# EasyEDA schematic SCH_ESP32-Head-Module_2024-04-16.json
TITLE: Sheet_1; REV: 1.0; Date: 2024-04-16; Sheet: 1/1; Drawn By: fcbayernmunchenerlan999; Company: Your Company
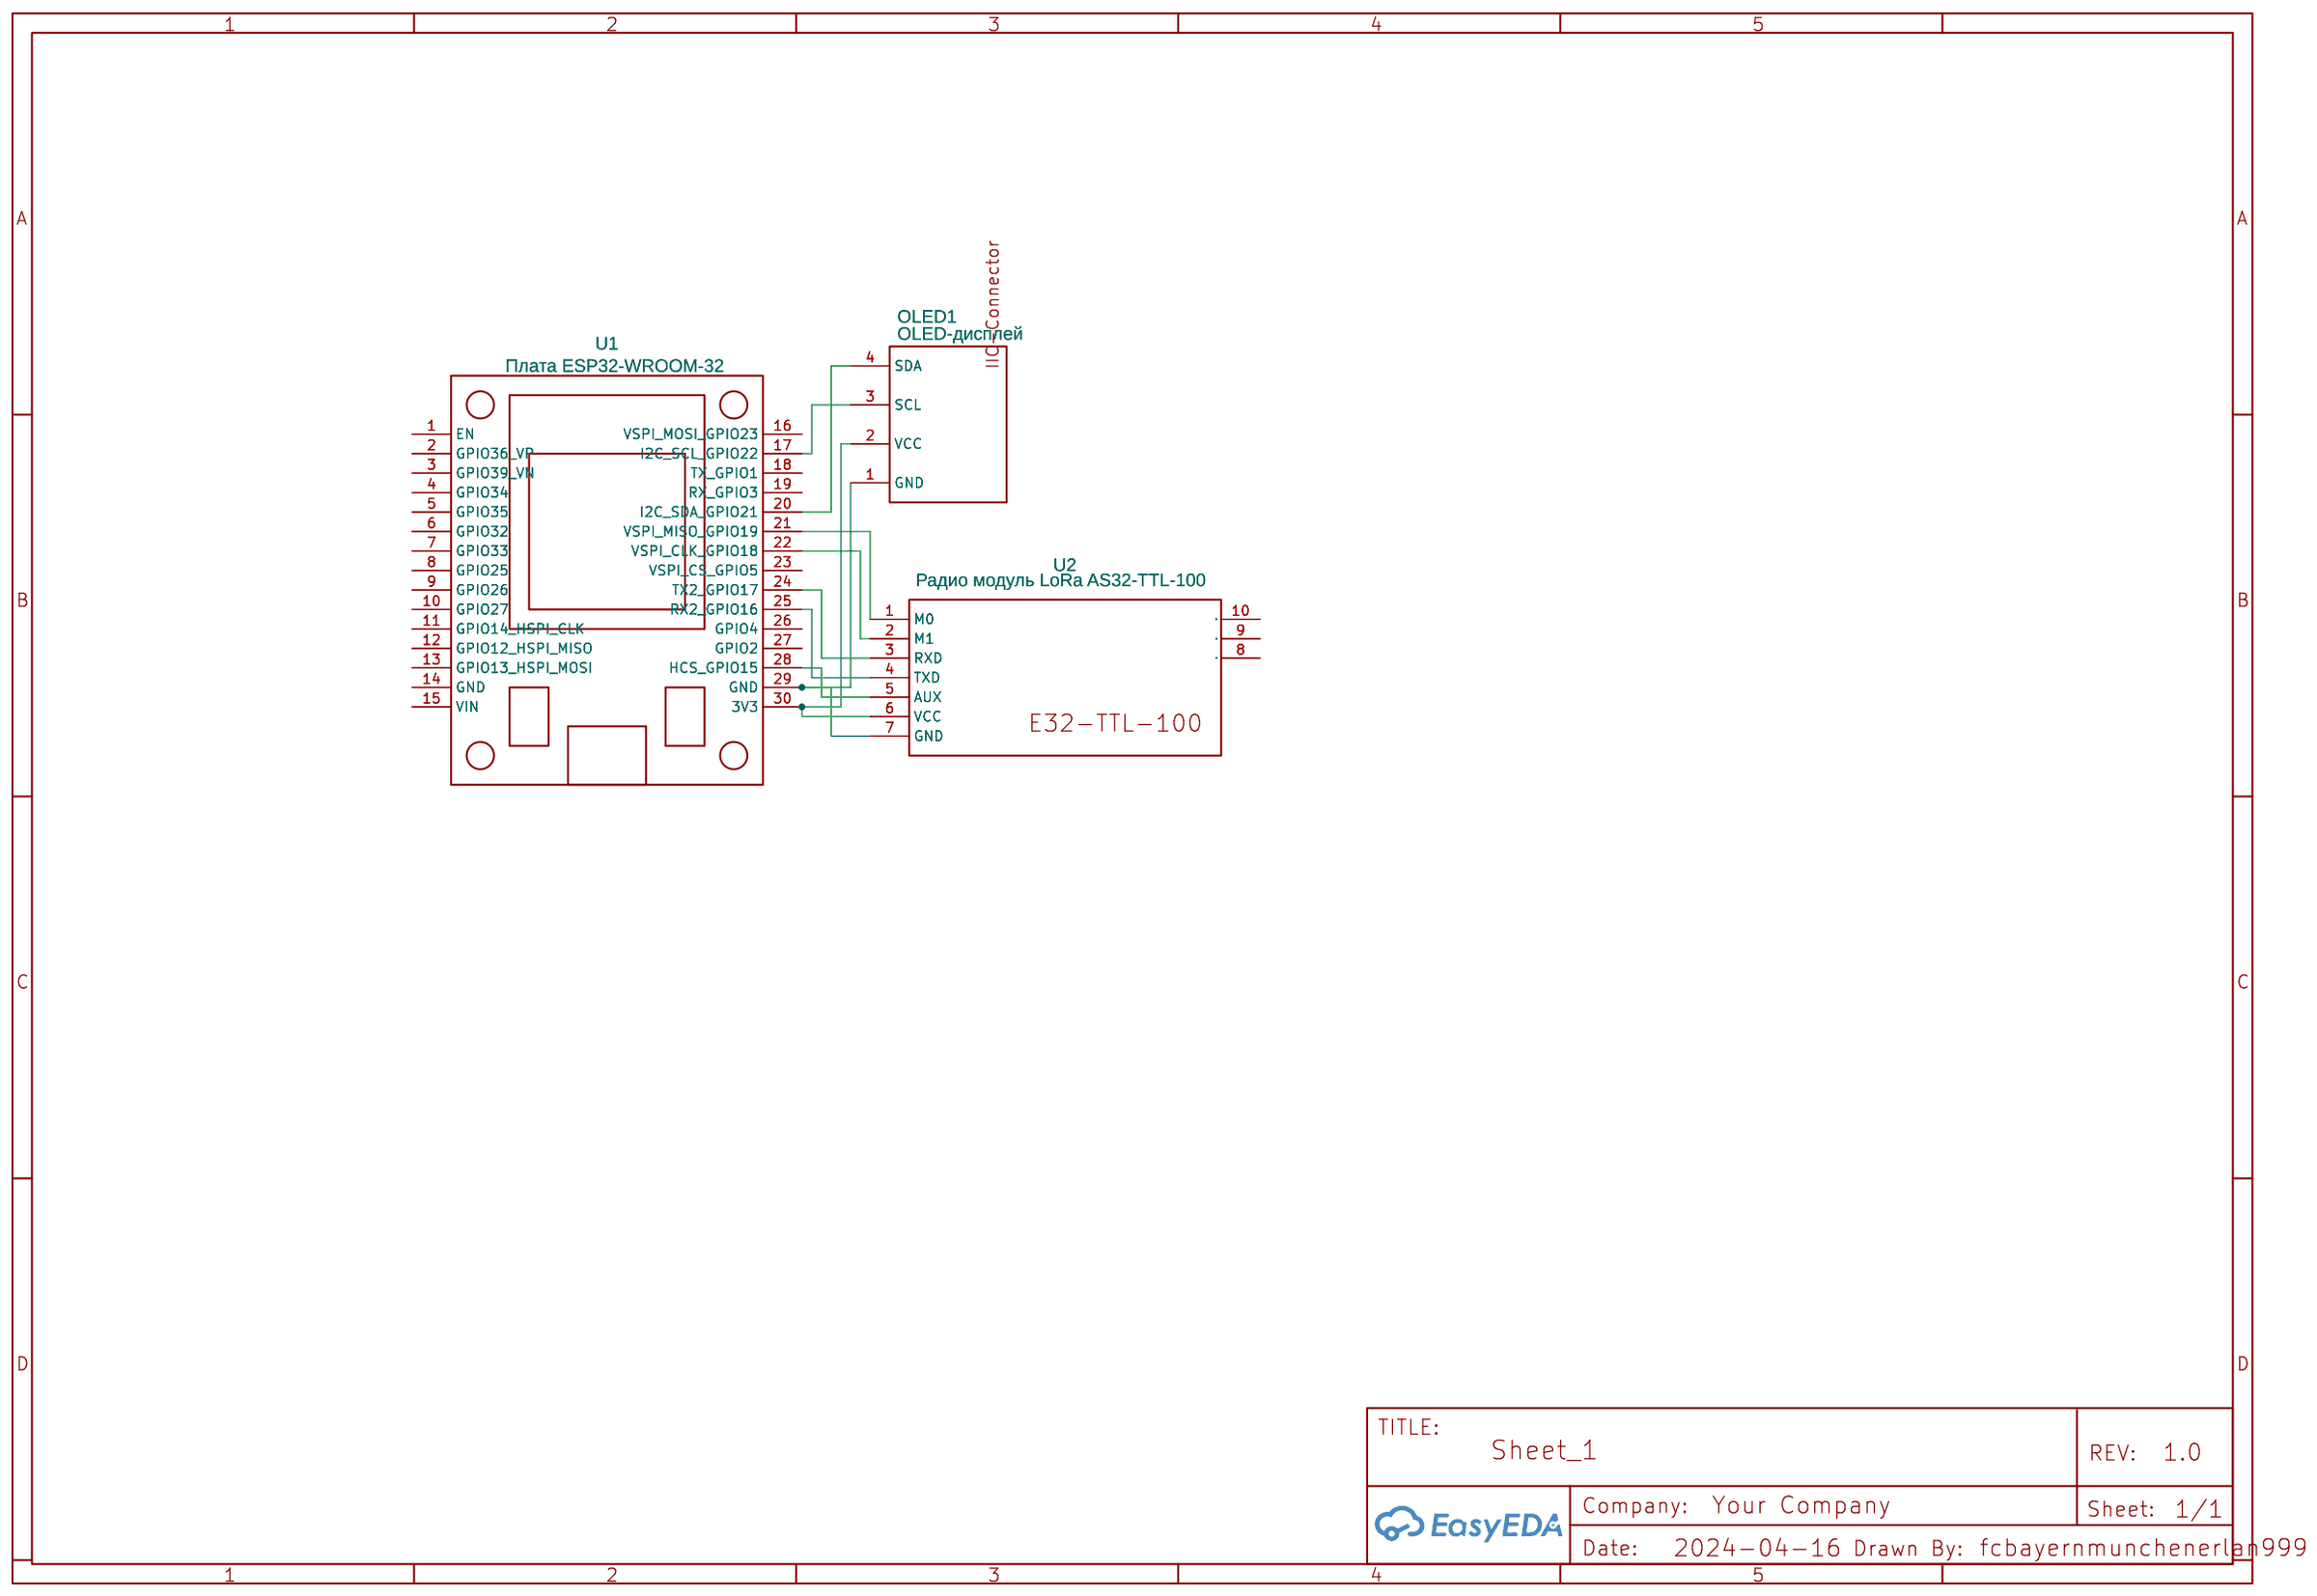
[diagram p0: schematic sheet]

## Parts
OLED1  OLED-дисплей  [0.96OLED_4P]
U1  Плата ESP32-WROOM-32  [ESP32S 30PIN DEVBOARD]
U2  Радио модуль LoRa AS32-TTL-100  [WIRELM-TH_E32-433T20DC]

## Library data of the parts
OLED1 = 0.96OLED_4P_MODULE_JX: Contributor: LCSC; Supplier: LCSC; Supplier Part: C9900004566; Manufacturer: null; JLCPCB Part Class: Extended Part; Package Display: No
U1 = Плата ESP32 (вариант 2): Contributor: PhilD; Package Display: No
U2 = E32-TTL-100: Contributor: LCSC; Supplier: LCSC; Supplier Part: C97350; Manufacturer: EBYTE(亿佰特); Manufacturer Part: E32-433T20DC; JLCPCB Part Class: Extended Part; Package Display: No

## Nets
Net-(OLED1-1): OLED1.1(GND) U1.29(GND) U2.7(GND)
Net-(OLED1-2): OLED1.2(VCC) U1.30(3V3) U2.6(VCC)
Net-(OLED1-3): OLED1.3(SCL) U1.17(I2C SCL GPIO22)
Net-(OLED1-4): OLED1.4(SDA) U1.20(I2C SDA GPIO21)
Net-(U1-21): U1.21(VSPI MISO GPIO19) U2.1(M0)
Net-(U1-22): U1.22(VSPI CLK GPIO18) U2.2(M1)
Net-(U1-24): U1.24(TX2 GPIO17) U2.3(RXD)
Net-(U1-25): U1.25(RX2 GPIO16) U2.4(TXD)
Net-(U1-28): U1.28(HCS GPIO15) U2.5(AUX)

Not connected (* = marked no-connect by the designer): U1 1(EN) 2(GPIO36 VP) 3(GPIO39 VN) 4(GPIO34) 5(GPIO35) 6(GPIO32) 7(GPIO33) 8(GPIO25) 9(GPIO26) 10(GPIO27) 11(GPIO14 HSPI CLK) 12(GPIO12 HSPI MISO) 13(GPIO13 HSPI MOSI) 14(GND) 15(VIN) 16(VSPI MOSI GPIO23) 18(TX GPIO1) 19(RX GPIO3) 23(VSPI CS GPIO5) 26(GPIO4) 27(GPIO2); U2 8 9 10
